# EasyEDA Pro project ProPrj_ftdi-jtag-xilinx_2025-01-10_v2.epro, board PCB1
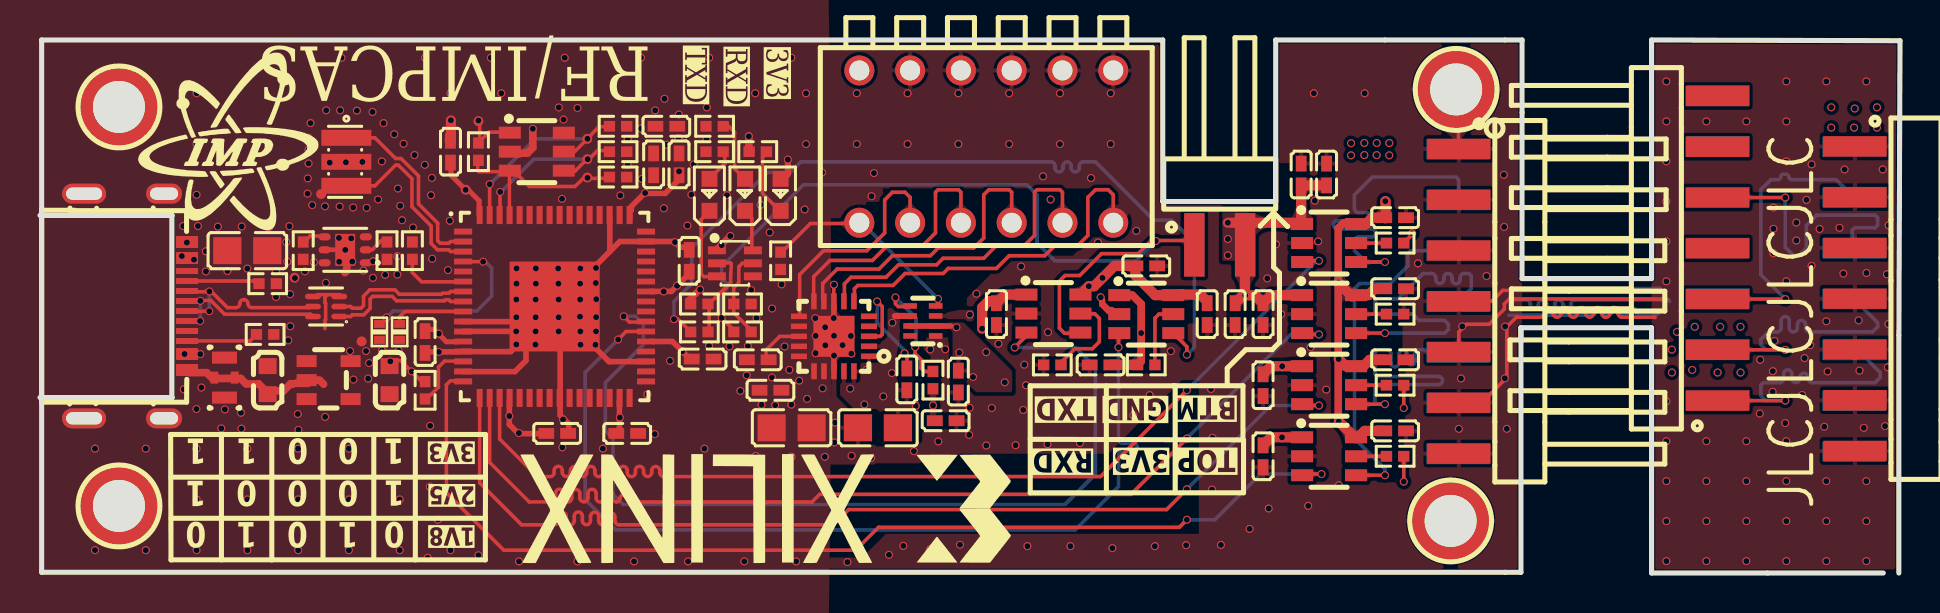
[diagram p3: board, top side]
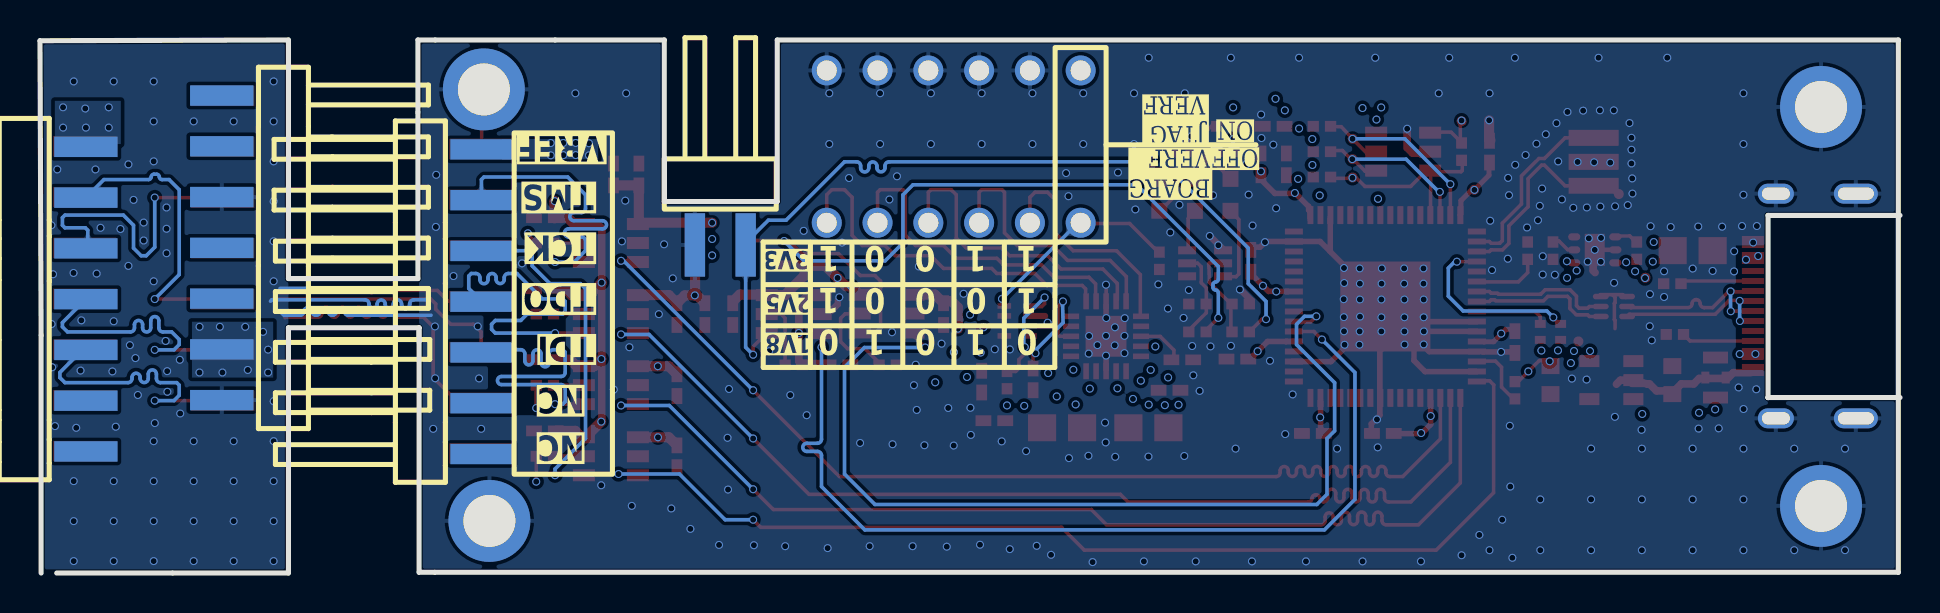
[diagram p4: board, bottom side, seen from below]

Outline 93.03 x 26.67 mm; copper layers: Top Layer, Inner1, Inner2, Bottom Layer. Coordinates in mm from the lower left corner of the outline.
Outline path: 74.07,12.27 80.6,12.27 80.6,0 92.19,0 ; 74.07,12.27 74.07,11.57 ; 74.07,12.27 74.07,0.04 0.08,0.04 0.08,26.67 56.15,26.67 56.15,18.59 61.8,18.59 61.8,26.67 74.12,26.67 74.12,14.73 80.6,14.73 80.6,19.3 80.6,19.3 80.6,26.67 93.03,26.63 92.97,11.9 92.97,0
Stack: Top Layer 0.035mm 外层铜厚1oz / Dielectric1 0.2104mm 7628 RC49% 8.6mil / Inner1 0.0152mm 内层铜厚 / Dielectric2 1.065mm 1.1mm H/HOZ Copper / Inner2 0.0152mm 内层铜厚 / Dielectric3 0.2104mm 7628 RC49% 8.6mil / Bottom Layer 0.035mm 外层铜厚1oz

## Design rules (mm)
net USB_DP_O: USB2
net USB_DN_O: USB2
net USB_DN: USB1
net USB_DP: USB1
net OSCO: OSC
net OSCI: OSC
template: 自定义配置
spacing copperThickness1oz (default): track to track 0.102, other pairs 0.152 to 0.3
spacing copperThickness2oz: track to track 0.203, other pairs 0.152 to 0.3
track width copperThickness1oz (default): min 0.127, default 0.178, max 2.54
track width copperThickness2oz: min 0.203, default 0.254, max 2.54
differential pair differentialPair (default): width min 0.127, default 0.254, max 2.54; gap min 0.152, default 0.152
via viaSize (default): diameter min 0.4, default 0.4, max 10; hole min 0.3, default 0.3, max 6.299

## Placement (name value [footprint] x y rotation side)
C1  100nF  [C0402]  25.87 6.98 180 top
C2  100nF  [C0402]  29.37 6.98 180 top
C3  100nF  [C0402]  32.47 15.62 270 top
C4  100nF  [C0402]  30.69 20.45 270 top
C5  100nF  [C0402]  59.77 12.95 90 top
C6  100nF  [C0402]  64.35 19.94 270 top
C7  100nF  [C0402]  55.33 15.37 180 top
C8  100nF  [C0402]  47.84 12.95 90 top
C9  100nF  [C0402]  31.96 20.45 270 top
C10  100nF  [C0402]  33.14 10.7 180 top
C11  100nF  [C0402]  20.53 21.08 270 top
C12  10uF  [C0603]  11.39 9.65 270 top
C13  4.7uF  [C0402]  19.26 11.56 270 top
C14  100nF  [C0402]  31.33 22.35 180 top
C15  NFM21PC104R1E3D  [CAP-SMD_4P-L2.0-W1.25]  9.23 9.78 270 top
C16  10uF  [C0603]  17.48 9.65 90 top
C17  22uF  [C0805]  10.37 16.13 0 top
C23  22uF  [C0805]  37.59 7.27 180 top
C24  100nF  [C0402]  36.53 9.14 180 top
C25  22uF  [C0805]  41.91 7.27 180 top
C26  100nF  [C0402]  61.17 12.95 90 top
C27  100nF  [C0402]  45.3 7.62 180 top
C28  100nF  [C0402]  67.78 17.78 180 top
C29  100nF  [C0402]  45.93 9.58 90 top
C30  10nF  [C0402]  35.9 10.67 180 top
C31  10nF  [C0402]  43.35 9.69 90 top
C32  100nF  [C0402]  61.17 9.4 90 top
C33  100nF  [C0402]  58.38 12.95 90 top
C34  100nF  [C0402]  53.04 10.41 0 top
C35  100nF  [C0402]  67.78 7.11 180 top
C36  100nF  [C0402]  63.08 19.94 270 top
C37  100nF  [C0402]  67.78 14.22 180 top
C38  100nF  [C0402]  61.17 5.84 90 top
C39  100nF  [C0402]  67.78 10.67 180 top
L1  ECMF02-2AMX6  [UFQFN-6_L1.7-W1.5]  14.31 13.33 180 top
L2  BLM15PD121SN1D  [L0402]  17.99 12.06 270 top
L3  BLM15PD121SN1D  [L0402]  16.98 12.06 90 top
LED1  NCD0603Y1  [LED0603-RD]  37.04 18.92 90 top
LED2  NCD0603Y1  [LED0603-RD]  35.26 18.92 90 top
LED3  NCD0603Y1  [LED0603-RD]  33.49 18.92 90 top
Q1  BSS138PS,115  [SOT-363_L2.0-W1.3-P0.65-LS2.1-BR]  34.75 15.49 180 top
R1  5.1kΩ  [R0402]  11.26 11.94 180 top
R2  5.1kΩ  [R0402]  11.39 14.48 180 top
R3  10kΩ  [R0402]  35.9 21.08 0 top
R4  10kΩ  [R0402]  33.74 22.35 180 top
R5  100kΩ  [R0402]  32.98 13.46 0 top
R6  56kΩ  [R0402]  17.36 16.13 270 top
R7  100Ω  [R0402]  32.98 12.06 180 top
R8  100kΩ  [R0402]  35.14 13.46 0 top
R9  100Ω  [R0402]  35.14 12.06 0 top
R10  10kΩ  [R0402]  28.91 22.35 180 top
R11  10kΩ  [R0402]  28.91 21.08 180 top
R12  200kΩ  [R0402]  13.17 16.13 270 top
R13  10kΩ  [R0402]  33.74 21.08 0 top
R14  12kΩ  [R0402]  18.63 16.13 270 top
R15  1kΩ  [R0402]  19.26 9.14 270 top
R18  2kΩ  [R0402]  21.93 21.08 270 top
R19  10kΩ  [R0402]  28.91 19.81 0 top
R20  10kΩ  [R0402]  44.66 9.65 90 top
R21  10kΩ  [R0402]  37.04 15.62 90 top
R22  10kΩ  [R0402]  67.78 5.84 0 top
R23  10kΩ  [R0402]  67.78 9.4 0 top
R24  10kΩ  [R0402]  67.78 12.95 0 top
R25  10kΩ  [R0402]  67.78 16.51 0 top
R26  10kΩ  [R0402]  55.33 10.41 180 top
R27  10kΩ  [R0402]  50.63 10.41 180 top
SW1  SMQP-06B-TP  [SW-TH_12P-P2.54_SMQP-06B-TP]  47.33 21.34 180 top
TP1  -  [Test-Point-0.5mm]  21.29 19.18 0 top
TP2  -  [Test-Point-0.5mm]  12.73 14.78 270 top
TP3  -  [Test-Point-0.5mm]  16.09 11.59 0 top
TP4  -  [Test-Point-0.5mm]  27.37 21.72 0 top
TP5  -  [Test-Point-0.5mm]  27.37 20.71 0 top
TP6  -  [Test-Point-0.5mm]  21.93 22.61 0 top
TP9  -  [Test-Point-0.5mm]  27.37 19.79 0 top
TP13  -  [Test-Point-0.5mm]  14.06 18.96 0 top
U1  -  [JTAG_V3]  71.08 13.59 0 top
U2  FT2232HQ-REEL  [QFN-64_L9.0-W9.0-P0.50-TL-EP4.3]  25.74 13.33 0 top
U3  -  [2x2p侧贴排针]  59 16.42 90 top
U4  TPS25200DRVR  [WSON-6_L2.0-W2.0-P0.65-TL-EP]  15.27 16.17 180 top
U5  TPS7A2033PDBVR  [SOT-23-5_L2.9-W1.6-P0.95-LS2.8-BR]  14.44 9.65 180 top
U6  93LC56BT-I/OT  [SOT-23-6_L2.9-W1.6-P0.95-LS2.8-BR]  24.85 21.08 180 top
U11  TPS7A8300RGRR  [VQFN-20_L3.5-W3.5-P0.50-BL-EP2.0]  39.71 11.84 90 top
U12  -  [M2焊接螺柱]  3.95 23.32 0 top
U13  -  [M2焊接螺柱]  70.55 2.61 90 top
U14  -  [M2焊接螺柱]  3.95 3.36 0 top
U15  -  [M2焊接螺柱]  70.83 24.2 90 top
U16  TPS2116DRLR  [SOT-583-8_L2.1-W1.6-P0.50-LS1.6-BL]  44.16 12.61 90 top
U22  SN74LVC1T45DBVR  [SOT-23-6_L2.9-W1.6-P0.95-LS2.8-BR]  64.47 5.84 180 top
U23  SN74LVC1T45DBVR  [SOT-23-6_L2.9-W1.6-P0.95-LS2.8-BR]  64.47 9.4 180 top
U24  SN74LVC1T45DBVR  [SOT-23-6_L2.9-W1.6-P0.95-LS2.8-BR]  64.47 12.95 180 top
U25  SN74LVC1T45DBVR  [SOT-23-6_L2.9-W1.6-P0.95-LS2.8-BR]  64.47 16.51 180 top
U26  SN74LVC1T45DBVR  [SOT-23-6_L2.9-W1.6-P0.95-LS2.8-BR]  55.33 12.95 180 top
U27  SN74LVC1T45DBVR  [SOT-23-6_L2.9-W1.6-P0.95-LS2.8-BR]  50.69 12.98 180 top
U28  -  [JTAG_V3]  90.89 13.72 0 top
U29  -  [JTAG_V3]  83.78 16.26 180 top
USB1  TYPEC-302-BRP16SC16  [USB-C-SMD_TYPEC-302-BRP16SC16]  4.78 13.36 270 top
X1  12MHz  [CRYSTAL-SMD_3P-L3.2-W1.3-P1.2-BL]  15.32 20.57 270 top

## Footprints (pads in the part's own frame, mm; a bottom-side part is the same pattern mirrored in y, then rotated)
2x2p侧贴排针
  rect 3.17x1.02 smd: 1(0,1.27) 3(0,-1.27)
  rect 3.17x1.02 smd far side: 2(0,1.27) 4(0,-1.27)
C0402
  rect 0.79x0.54 smd: 1(-0.545,0) 2(0.545,0)
C0603
  rect 0.8x0.9 smd: 1(-0.7,0) 2(0.7,0)
C0805
  rect 1.41x1.35 smd: 1(-1,0) 2(1,0)
CAP-SMD_4P-L2.0-W1.25
  rect 0.6x1.25 smd: 1(-1,0) 3(1,0)
  rect 0.6x0.4 smd: 2(0,-0.508) 4(0,0.508)
CRYSTAL-SMD_3P-L3.2-W1.3-P1.2-BL
  rect 0.8x2.5 smd: 1(-1.2,0) 2(0,0) 3(1.2,0)
JTAG_V3
  rect 3.17x1.02 smd: 1(-0.114,7.63) 3(-0.114,5.09) 5(-0.114,2.55) 7(-0.114,0.01) 9(-0.114,-2.53) 11(-0.114,-5.07) 13(-0.114,-7.61)
  rect 3.17x1.02 smd far side: 2(-0.158,7.606) 4(-0.158,5.066) 6(-0.158,2.526) 8(-0.158,-0.014) 10(-0.158,-2.554) 12(-0.158,-5.094) 14(-0.158,-7.634)
L0402
  rect 0.4x0.55 smd: 1(-0.4,0) 2(0.4,0)
LED0603-RD
  rect 0.8x0.8 smd: 1(-0.799,0) 2(0.799,0)
M2焊接螺柱
  round 4.1 hole 2.6: 1(0,0)
QFN-64_L9.0-W9.0-P0.50-TL-EP4.3
  rect 0.9x0.3 smd: 1(-4.575,3.75) 2(-4.575,3.25) 3(-4.575,2.75) 4(-4.575,2.25) 5(-4.575,1.75) 6(-4.575,1.25) 7(-4.575,0.75) 8(-4.575,0.25) 9(-4.575,-0.25) 10(-4.575,-0.75) 11(-4.575,-1.25) 12(-4.575,-1.75) 13(-4.575,-2.25) 14(-4.575,-2.75) 15(-4.575,-3.25) 16(-4.575,-3.75) 33(4.575,-3.75) 34(4.575,-3.25) 35(4.575,-2.75) 36(4.575,-2.25) 37(4.575,-1.75) 38(4.575,-1.25) 39(4.575,-0.75) 40(4.575,-0.25) 41(4.575,0.25) 42(4.575,0.75) 43(4.575,1.25) 44(4.575,1.75) 45(4.575,2.25) 46(4.575,2.75) 47(4.575,3.25) 48(4.575,3.75)
  rect 0.3x0.9 smd: 17(-3.75,-4.575) 18(-3.25,-4.575) 19(-2.75,-4.575) 20(-2.25,-4.575) 21(-1.75,-4.575) 22(-1.25,-4.575) 23(-0.75,-4.575) 24(-0.25,-4.575) 25(0.25,-4.575) 26(0.75,-4.575) 27(1.25,-4.575) 28(1.75,-4.575) 29(2.25,-4.575) 30(2.75,-4.575) 31(3.25,-4.575) 32(3.75,-4.575) 49(3.75,4.575) 50(3.25,4.575) 51(2.75,4.575) 52(2.25,4.575) 53(1.75,4.575) 54(1.25,4.575) 55(0.75,4.575) 56(0.25,4.575) 57(-0.25,4.575) 58(-0.75,4.575) 59(-1.25,4.575) 60(-1.75,4.575) 61(-2.25,4.575) 62(-2.75,4.575) 63(-3.25,4.575) 64(-3.75,4.575)
  rect 4.5x4.5 smd: 65(0,-0.001)
R0402
  rect 0.566x0.54 smd: 1(-0.433,0) 2(0.433,0)
SOT-23-5_L2.9-W1.6-P0.95-LS2.8-BR
  rect 1x0.6 smd: 1(1.1,-0.95) 2(1.1,0) 3(1.1,0.95) 4(-1.1,0.95) 5(-1.1,-0.95)
SOT-23-6_L2.9-W1.6-P0.95-LS2.8-BR
  rect 1.1x0.6 smd: 1(1.35,-0.95) 2(1.35,0) 3(1.35,0.95) 4(-1.35,0.95) 5(-1.35,0) 6(-1.35,-0.95)
SOT-363_L2.0-W1.3-P0.65-LS2.1-BR
  rect 0.9x0.4 smd: 1(0.9,-0.65) 2(0.9,0) 3(0.9,0.65) 4(-0.9,0.65) 5(-0.9,0) 6(-0.9,-0.65)
SOT-583-8_L2.1-W1.6-P0.50-LS1.6-BL
  rect 0.28x0.68 smd: 1(-0.75,-0.64) 2(-0.25,-0.64) 3(0.25,-0.64) 4(0.75,-0.64) 5(0.75,0.64) 6(0.25,0.64) 7(-0.25,0.64) 8(-0.75,0.64)
SW-TH_12P-P2.54_SMQP-06B-TP
  round 1.5 hole 1: 1(-6.35,-3.81) 2(-3.81,-3.81) 3(-1.27,-3.81) 4(1.27,-3.81) 5(3.81,-3.81) 6(6.35,-3.81) 7(6.35,3.81) 8(3.81,3.81) 9(1.27,3.81) 10(-1.27,3.81) 11(-3.81,3.81) 12(-6.35,3.81)
Test-Point-0.5mm
  round 0.5 smd: 1(0,0)
UFQFN-6_L1.7-W1.5
  oval 0.79x0.28 smd: 1(-0.657,0.5) 2(-0.657,0) 3(-0.657,-0.5) 4(0.657,-0.5) 5(0.657,0) 6(0.657,0.5)
USB-C-SMD_TYPEC-302-BRP16SC16
  rect 0.6x1.1 smd: 1(-3.2,2.575) 2(-2.4,2.575) 11(2.4,2.575) 12(3.2,2.575)
  rect 0.3x1.1 smd: 3(-1.75,2.575) 4(-1.25,2.575) 5(-0.75,2.575) 6(-0.25,2.575) 7(0.25,2.575) 8(0.75,2.575) 9(1.25,2.575) 10(1.75,2.575)
  oval 1x1.8 hole 0.61x1.4: 13(-5.62,1.425) 14(5.62,1.425)
  oval 1x2.2 hole 0.61x1.8: 15(-5.62,-2.575) 16(5.62,-2.575)
VQFN-20_L3.5-W3.5-P0.50-BL-EP2.0
  rect 0.28x0.8 smd: 1(-1.001,-1.751) 2(-0.501,-1.751) 3(-0.001,-1.751) 4(0.499,-1.751) 5(1,-1.749) 11(0.999,1.749) 12(0.501,1.751) 13(-0.001,1.749) 14(-0.501,1.749) 15(-1.001,1.749)
  rect 0.8x0.28 smd: 6(1.75,-0.999) 7(1.75,-0.499) 8(1.75,0.001) 9(1.75,0.501) 10(1.75,1.001) 16(-1.75,0.999) 17(-1.75,0.499) 18(-1.75,-0.001) 19(-1.75,-0.501) 20(-1.75,-1.001)
  rect 2.05x2.05 smd: 21(-0.001,-0.001)
WSON-6_L2.0-W2.0-P0.65-TL-EP
  oval 0.607x0.364 smd: 1(-1.028,0.65) 2(-1.028,0) 3(-1.028,-0.65) 4(1.028,-0.65) 5(1.028,0) 6(1.028,0.65)
  rect 1x1.6 smd: 7(0,0)

## Nets
As in the schematic.

Pads without a net: U1 12 14; U2 21 22 23 24 26 27 28 29 30 32 33 34 36 40 41 43 44 45 46 48 52 53 54 55 57 58 59 60; U4 3; U5 4; U11 4 5 12; U16 8; U28 12 14; U29 6 7 8 11 12 13 14; USB1 3 9

## Via types
v1: diameter 0.4, hole 0.3, Top Layer to Bottom Layer, 499 vias

## Routing (per net, layer and track width the routed paths; a pad name or vN(x,y) marks a point on that pad's centre or on a via; arc(x,y) is an arc through that point)
3V3: length 40.4
  Top Layer w0.178: 19.14,9.53 18.04,10.63 17.74,10.63 ; v1(68.63,17) 68.63,16.93 R25.2 ; R22.2 v1(68.21,4.57) ; R23.2 v1(68.21,8.25)
  Top Layer w0.28: 30.58,14.09 31.58,14.09 32.44,14.95 ; 28.71,6.96 28.98,7.23 28.98,8.62 ; 25.2,6.98 23.93,6.98 23.47,7.43 v1(23.47,7.85) 23.47,8.6
  Top Layer w0.305: v1(37.4,20.69) 37.4,19.95 37.04,19.58
  Top Layer w0.381: 54.92,10.44 55.08,10.59 55.08,13.46 54.63,13.9 U26.1
  Top Layer w0.508: v1(47.12,12.22) 47.12,13.28 47.44,13.6 47.89,13.6 ; C32.2 61.58,10.35 v1(62.13,10.35) U23.1 ; 60.26,14.13 60.26,16.41 60.27,16.42 ; 60.26,14.13 60.28,14.12 v1(60.28,13.89) ; 60.26,14.13 60.26,13.91 v1(60.28,13.89) ; U27.1 48.27,13.93 C8.2 ; 63.12,6.79 v1(62.12,6.79) 61.58,6.79 C38.2 ; 54.92,10.44 54.78,10.41 53.53,10.41 ; v1(59.41,17.53) 63.06,17.53 63.08,17.51 ; v1(60.28,13.89) 60.78,13.89 C26.2 61.58,13.9 U24.1 ; v1(60.28,13.89) 60.16,13.89 C5.2 ; C6.2 C36.2 63.08,17.51 ; 63.08,17.51 U25.1
  vias: v1(15.51,11.11) v1(16.31,11.11) v1(16.46,10.51) v1(17.11,11.14) v1(17.52,10.59) v1(17.94,11.13) v1(18.59,10.09) v1(23.95,7) v1(25.95,23.29) v1(26.11,18.72) v1(26.19,22.69) v1(26.88,23.27) v1(29.02,18.89) v1(29,7.79) v1(29.4,21.71) v1(29.39,20.42) v1(30.05,22.24) v1(30.1,19.72) v1(30.77,23.15) v1(31.2,14.09) v1(31.23,23.73) v1(31.86,14.37) v1(33.35,23.3) v1(33.34,21.71) v1(44.66,8.39) v1(55.07,12.01) v1(59.41,16.71) v1(59.41,15.89)
+5V:
  vias: v1(9.25,8.19) v1(10.05,8.02) v1(12.89,7.96) v1(16.17,15.13) v1(16.66,15.6) v1(16.65,14.77) v1(36.09,8.42) v1(36.61,9.78) v1(36.77,8.4) v1(37.24,11.33) v1(37.48,10.16) v1(37.58,8.42) v1(37.97,9.62) v1(38.36,8.71) v1(39.14,9.24)
GND: length 119.9
  Top Layer w0.178: v1(39.71,14.43) 39.7,14.41 39.71,13.37 ; 70.94,21.25 70.94,23.16 ; 53.67,12.95 53.67,13.17 53.62,13.23 53.47,13.23 53.19,13.5 53.19,13.66 53.05,13.79 ; 53.05,13.79 53.05,13.41 53.42,13.04 53.55,13.17 ; 53.05,13.79 53.05,13.81 ; U1.7 72.61,13.6 73.15,14.14 81.03,14.14 ; 80.77,12.78 80.75,12.8 79.13,12.8 arc(78.98,12.86) 78.92,13 78.92,13.08 arc(78.72,13.28) 78.52,13.08 78.52,13 arc(78.31,12.8) 78.11,13 78.11,13.08 arc(77.91,13.28) 77.7,13.08 77.7,13 arc(77.5,12.8) 77.3,13 77.3,13.08 arc(77.09,13.28) 76.89,13.08 76.89,13 arc(76.69,12.8) 76.48,13 76.48,13.08 arc(76.28,13.28) 76.08,13.08 76.08,13 arc(75.88,12.8) 75.67,13 75.67,13.08 arc(75.47,13.28) 75.27,13.08 75.27,13 arc(75.21,12.86) 75.06,12.8 73.84,12.8 73.36,12.32 73.36,9.78 72.1,8.52 U1.11 ; 14.37,13.92 14.25,13.8 14.25,13.53 14.29,13.49 14.29,12.68 14.25,12.64 14.25,12.23 ; 15.03,13.88 14.99,13.93 13.87,13.93 13.72,13.78 ; U1.9 70.96,12.06 71.34,12.45 72.48,12.45 73.24,13.2 73.24,13.46 73.49,13.72 81.36,13.72
  Top Layer w0.229: 14.38,16.17 14.85,16.17 14.86,16.16
  Top Layer w0.28: 24.01,12.2 23.89,12.09 21.16,12.09 ; 39.77,12.02 39.71,11.96 39.71,10.17 ; 19.3,11.06 v1(19.95,11.06) 20.91,11.06 ; 32.37,16.3 32.01,16.3 31.73,16.59 29,16.59 28.5,16.08 28.5,17.77 ; 26.45,6.96 26.45,7.46 26.02,7.89 26.02,11.11 25.79,11.33 ; 30.45,10.58 28.46,10.58 27.54,11.49 ; 28.44,16.03 27.7,15.28 ; 21.08,11.08 23.54,11.08 23.74,11.27 ; 21.16,12.58 23.71,12.58 ; 21.16,10.08 23.75,10.08 24.31,10.63 24.31,11.33 24.32,11.34 ; 39.71,12.02 39.71,13.37
  Top Layer w0.33: 33.01,14.2 32.46,13.65 32.46,13.46 ; 33.8,16.15 34.51,16.85 34.52,16.85
  Top Layer w0.381: 12.6,9.45 12.63,9.45 arc(12.73,9.48) 12.83,9.49 13.4,9.49 13.51,9.61 ; 15.35,15.92 15.35,15.13 15.25,15.03 ; 8.73,9.74 9.64,9.74 ; 9.64,9.74 10.04,9.74 10.31,9.46 10.94,9.46 11.52,8.88 ; 9.64,9.74 9.67,9.77 ; 14.18,9.45 13.98,9.65 13.48,9.65 ; 35.45,21.04 35.45,21.87 ; 7.47,10.02 8.33,10.02 8.62,9.74 ; v1(24.65,22.23) 24.65,21.28 24.37,21.01 23.47,21.01 ; 11.34,9.11 12.18,9.11 12.53,9.46 12.59,9.46
  Top Layer w0.508: 20.55,22.65 20.55,21.71 20.49,21.65
  Bottom Layer w0.178: 73.47,12.9 77.61,12.9 arc(77.74,12.95) 77.8,13.08 arc(77.85,13.21) 77.98,13.27 78.02,13.27 arc(78.15,13.21) 78.2,13.08 arc(78.26,12.95) 78.39,12.9 78.43,12.9 arc(78.56,12.95) 78.61,13.08 arc(78.67,13.21) 78.8,13.27 78.83,13.27 arc(78.96,13.21) 79.02,13.08 arc(79.07,12.95) 79.2,12.9 79.24,12.9 arc(79.37,12.95) 79.42,13.08 arc(79.48,13.21) 79.61,13.27 79.65,13.27 arc(79.78,13.21) 79.83,13.08 arc(79.88,12.95) 80.01,12.9 80.83,12.9 80.94,13.01 ; 73.61,13.67 74.34,13.67 arc(74.48,13.61) 74.54,13.46 74.54,13.44 arc(74.74,13.23) 74.94,13.44 74.94,13.46 arc(75.15,13.67) 75.35,13.46 75.35,13.44 arc(75.56,13.23) 75.76,13.44 75.76,13.46 arc(75.96,13.67) 76.16,13.46 76.16,13.45 arc(76.37,13.25) 76.57,13.45 76.57,13.46 arc(76.63,13.61) 76.77,13.67 81.43,13.67 81.5,13.6 ; 73.56,14.24 81.02,14.24
  vias: v1(2.75,6.22) v1(2.75,1.14) v1(5.29,6.22) v1(5.29,1.14) v1(7.16,17.36) v1(7.19,9.19) v1(7.35,16.54) v1(7.83,24) v1(7.83,21.46) v1(7.83,18.92) v1(7.83,8.21) v1(7.83,6.22) v1(7.83,3.68) v1(7.83,1.14) v1(7.9,17.36) v1(8.07,9.28) v1(8.3,16.1) v1(8.3,15.09) v1(8.9,17.33) v1(9.07,7.24) v1(9.37,15.11) v1(10.09,17.34) v1(10.07,7.23) v1(10.37,15.23) v1(10.37,6.22) v1(10.37,3.68) v1(10.37,1.14) v1(11.47,17.31) v1(11.64,25.78) v1(11.8,15.1) v1(11.8,13.81) v1(12.42,11.64) v1(12.47,17.35) v1(12.51,13.95) v1(12.52,12.35) v1(12.92,7.16) v1(12.91,6.22) v1(12.91,3.68) v1(12.91,1.14) v1(13.43,21.78) v1(13.43,21.18) v1(13.43,20.49) v1(13.39,19.74) v1(13.38,18.98) v1(13.53,22.51) v1(13.62,18.41) v1(14.31,23.15) v1(14.25,18.35) v1(14.3,14.52) v1(14.26,7.81) v1(14.49,20.53) v1(15.01,23.15) v1(14.99,18.33) v1(14.95,16.77) v1(14.96,15.57) v1(15.08,25.78) v1(15.3,20.55) v1(15.27,16.17) v1(15.45,6.22) v1(15.45,3.68) v1(15.45,1.14) v1(15.56,16.74) v1(15.62,15.58) v1(15.66,18.29) v1(15.68,9.68) v1(15.85,23.13) v1(16.12,20.57) v1(16.34,18.27) v1(16.41,9.73) v1(16.63,23.07) v1(16.91,18.69) v1(17.1,20.6) v1(17.18,22.51) v1(17.26,14.92) v1(17.72,21.95) v1(17.9,19.24) v1(17.87,15.85) v1(17.87,14.93) v1(18.02,18.37) v1(17.99,3.68) v1(17.99,1.14) v1(18.11,17.65) v1(18.18,21.48) v1(18.73,20.91) v1(18.65,17.29) v1(19.26,25.78) v1(19.25,20.42) v1(19.39,0.76) v1(19.52,7.37) v1(19.49,4.32) v1(19.6,19.77) v1(19.56,18.9) v1(19.62,15.72) v1(19.9,2.67) v1(20.41,15.16) v1(20.53,24) v1(20.5,17.62) v1(20.53,1.14) v1(20.55,22.65) v1(21.04,1.91) v1(21.93,0.89) v1(22.55,25.78) v1(23.07,24) v1(23.83,15.24) v1(23.83,14.48) v1(23.82,13.68) v1(23.82,12.79) v1(23.82,12.09) v1(23.82,11.44) v1(23.96,0.58) v1(24.8,15.24) v1(24.8,14.48) v1(24.79,13.68) v1(24.79,12.79) v1(24.79,12.09) v1(24.78,11.43) v1(25.92,15.24) v1(25.93,14.48) v1(25.94,13.68) v1(25.94,12.79) v1(25.94,12.09) v1(26.12,6.29) v1(26.16,7.68) v1(26.25,25.78) v1(26.88,0.58) v1(27.03,15.24) v1(27.01,14.48) v1(27.01,13.68) v1(27.01,12.83) v1(27.03,12.09) v1(27.04,11.42) v1(27.81,15.26) v1(27.8,14.51) v1(27.82,13.7) v1(27.82,12.8) v1(27.81,12.09) v1(27.78,11.42) v1(28.15,6.22) v1(29.71,0.58) v1(30.06,25.78) v1(30.38,8.93) v1(30.75,6.95) v1(31.2,18.25) v1(31.34,21.43) v1(31.51,10.62) v1(31.76,16.56) v1(31.95,22.94) v1(31.94,21.76) v1(32.38,17.38) v1(32.41,0.58) v1(32.58,18.93) v1(32.7,20.45) v1(33.01,14.19) v1(33.23,6.22) v1(33.47,25.78) v1(33.46,11.37) v1(34.09,16.4) v1(34.36,18.9) v1(34.52,16.86) v1(34.49,11.34) v1(35.03,9.11) v1(35.22,0.58) v1(35.4,11.36) v1(35.34,9.89) v1(35.45,21.85) v1(35.57,14.16) v1(35.77,24) v1(35.83,12.76) v1(35.8,5.85) v1(36.04,18.42) v1(36.5,17.04) v1(36.61,13.23) v1(37.09,14.44) v1(37.58,25.78) v1(37.59,5.83) v1(37.82,0.58) v1(38.31,24) v1(38.31,21.46) v1(38.24,18.19) v1(38.78,12.75) v1(38.79,11.87) v1(38.79,11) v1(39.11,20.04) v1(39.27,12.3) v1(39.28,11.39) v1(39.25,5.81) v1(39.7,12.76) v1(39.71,11.87) v1(39.71,10.88) v1(39.73,6.54) v1(39.76,7.52) v1(40.14,11.4) v1(40.38,0.55) v1(40.56,11.86) v1(40.58,10.98) v1(40.59,5.86) v1(40.85,24) v1(40.85,21.46) v1(41.59,18.85) v1(41.56,5.75) v1(41.71,20.01) v1(42.46,0.91) v1(43.18,1.36) v1(43.39,24) v1(43.39,21.46) v1(43.71,6.1) v1(44.52,11.19) v1(44.53,1.2) v1(44.93,6.59) v1(45.27,11.2) v1(45.93,24) v1(45.93,21.46) v1(46.01,1.42) v1(46.49,8.27) v1(46.47,6.91) v1(46.83,13.97) v1(47.33,6.38) v1(47.6,8.26) v1(47.67,1.32) v1(47.94,11.47) v1(48.47,24) v1(48.47,21.46) v1(48.79,6.39) v1(49.07,15.34) v1(49.23,10.42) v1(49.18,8.16) v1(49.32,9.4) v1(49.38,1.34) v1(50.17,19.85) v1(50.41,12.05) v1(50.39,6.44) v1(50.55,18.69) v1(51.01,24) v1(51.01,21.46) v1(51.53,1.34) v1(52.01,6.51) v1(52.56,19.76) v1(52.91,16.53) v1(53.05,13.8) v1(53.55,24) v1(53.55,21.46) v1(53.63,1.25) v1(54.68,7.9) v1(54.83,17.12) v1(55.5,8.9) v1(55.76,1.34) v1(56.56,11.1) v1(57.32,1.39) v1(58.57,9.21) v1(58.62,4.18) v1(58.64,6.77) v1(59.06,1.41) v1(60.5,2.21) v1(61.38,14.74) v1(61.45,3.23) v1(61.81,16.45) v1(62.07,12.95) v1(63.43,3.36) v1(63.55,11.3) v1(63.71,24) v1(63.76,18.63) v1(63.92,16.59) v1(64.33,9.18) v1(64.96,4.39) v1(66.25,24) v1(68.92,15.49) v1(70.96,7.21) v1(71.13,12.34) v1(71.07,9.74) v1(72.35,14.86) v1(73.21,19.92) v1(73.23,17.32) v1(73.28,12.34) v1(73.26,9.74) v1(73.36,7.21) v1(81.34,24.6) v1(81.34,22.6) v1(81.34,20.6) v1(81.34,18.6) v1(81.34,16.6) v1(81.34,14.6) v1(81.34,8.6) v1(81.34,6.6) v1(81.34,4.6) v1(81.34,2.6) v1(81.34,0.6) v1(83.34,22.6) v1(83.34,6.6) v1(83.34,4.6) v1(83.34,2.6) v1(83.34,0.6) v1(85.34,22.6) v1(85.34,6.6) v1(85.34,4.6) v1(85.34,2.6) v1(85.34,0.6) v1(86.01,7.98) v1(86.03,10.67) v1(86.7,18.29) v1(86.7,17.22) v1(86.7,16) v1(86.67,10.1) v1(86.66,9.07) v1(86.74,11.61) v1(87.28,7.5) v1(87.34,24.6) v1(87.34,22.6) v1(87.34,20.6) v1(87.34,14.6) v1(87.34,6.6) v1(87.34,4.6) v1(87.34,2.6) v1(87.34,0.6) v1(87.84,17.54) v1(87.84,16.64) v1(88.13,8.91) v1(88.25,10.75) v1(88.35,18.67) v1(88.53,11.4) v1(88.6,20.45) v1(88.6,15.37) v1(89,17.21) v1(89.24,7.32) v1(89.34,24.6) v1(89.34,12.6) v1(89.41,10.09) v1(89.34,4.6) v1(89.34,2.6) v1(89.34,0.6) v1(90,17.27) v1(90.19,14.98) v1(90.25,20.19) v1(90.96,12.64) v1(91,10.13) v1(91.21,7.27) v1(91.34,24.6) v1(91.35,15.01) v1(91.34,4.6) v1(91.34,2.6) v1(91.34,0.6) v1(92.16,20.19) v1(92.28,7.35) v1(92.38,14.95) v1(92.42,10.3) v1(92.46,17.4) v1(92.45,12.46)
VCCB: length 30.3
  Top Layer w0.28: 43.47,12.36 45.55,12.36
  Top Layer w0.381: 65.67,17.5 65.18,17.5 64.93,17.25 64.93,7.59
  Top Layer w0.508: 57.01,13.93 58.03,13.93 58.36,13.6 ; C35.2 66.25,7.11 65.93,6.79 ; U26.6 55.78,13.9 54.78,14.9 C7.2 53.74,15.37 v1(53.14,14.76) 52.72,14.35 v1(52.46,14.35) U27.6 ; v1(67.28,18.61) 67.3,18.59 67.3,17.74 ; 65.62,13.84 64.94,14.52 v1(64.94,14.53) ; U24.6 66.44,13.9 66.76,14.22 C37.2 ; C39.2 66.5,10.67 66.19,10.35 66.1,10.35 65.31,10.35 v1(64.95,10.71) ; C28.2 66.63,17.78 66.31,17.46 U25.6 ; 65.79,6.74 64.96,7.57
  vias: v1(45.84,12.29) v1(45.98,11.03) v1(46.66,9.81) v1(47.32,11.05) v1(48.25,9.54) v1(64.96,7.57)
100MV: length 18.2
  Top Layer w0.178: 40.73,13.63 40.73,14.22 40.9,14.39 42.67,14.39 43.26,14.99 45.17,14.99 45.42,15.24 47.84,15.24 48.47,15.88 50.25,15.88 50.76,16.38 51.9,16.38 52.41,16.89 52.41,18.8 52.79,19.18 53.42,19.18 53.68,18.92 SW1.12
200MV: length 16.6
  Top Layer w0.178: SW1.11 51.14,19.05 51.01,19.18 49.87,19.18 49.74,19.05 49.74,16.89 49.23,16.38 47.84,16.38 47.2,15.75 45.17,15.75 44.84,15.42 42.94,15.42 42.31,14.8 40.56,14.8 40.23,14.47 40.23,13.59 ; 51.15,17.43 51.2,17.43
400MV: length 15
  Top Layer w0.178: 39.15,13.68 39.15,14.49 39.87,15.21 41.96,15.21 42.63,15.88 44.53,15.88 44.92,16.26 46.7,16.26 47.2,16.76 47.2,18.92 47.46,19.18 48.47,19.18 48.6,19.05 SW1.10
800MV: length 13.3
  Top Layer w0.178: 38.69,13.43 38.69,14.83 39.5,15.64 41.63,15.64 42.38,16.38 44.15,16.38 44.79,17.02 44.79,19.05 44.91,19.18 45.93,19.18 46.06,19.05 SW1.9
1600MV: length 11.8
  Top Layer w0.178: 38,12.82 38,12.86 ; 38,12.86 38,14.93 ; 38,12.86 38.09,12.86 ; 37.99,14.93 39.18,16.12 41.35,16.12 42.25,17.02 42.25,18.67 42.63,19.05 43.26,19.05 43.52,18.8 SW1.8
EE_CLK: length 8.6
  Top Layer w0.178: 23.01,17.88 23.01,19.08 ; 27.29,20.64 26.75,20.1 26.24,20.1 ; 27.45,20.7 27.89,21.14 28.37,21.14
  Bottom Layer w0.178: 23.07,19.08 24.7,20.71 v1(27.39,20.71)
  vias: v1(23.02,19.07)
EE_CS: length 10.3
  Top Layer w0.178: 27.36,21.7 27.54,21.88 ; 27.36,21.7 27.94,22.33 28.28,22.33 ; 27.36,21.7 26.66,21.01 26.04,21.01 ; 22.49,18.05 22.49,19.47
  Bottom Layer w0.178: v1(27.38,21.72) 24.76,21.72 22.49,19.45
  vias: v1(22.49,19.46)
EE_DI: length 9.6
  Top Layer w0.178: 27.37,19.81 27.23,19.81 26.76,19.34 24.47,19.34 23.73,20.08 23.62,20.08 ; 21.89,20.56 21.89,20.14 21.95,20.08 23.53,20.08 ; 27.42,19.75 28.33,19.75 28.4,19.81 ; 23.58,20.1 23.48,19.99 23.48,18.03 23.45,18.01 23.45,17.89
  vias: v1(27.39,19.77)
EE_DO: length 2.7
  Top Layer w0.178: 23.53,22.06 22.45,22.06 22.02,21.62 ; 21.99,21.54 21.99,22.52 21.98,22.54
  vias: v1(21.93,22.64)
INT_VERF: length 0.8
  Top Layer w0.305: U16.6 42.76,12.86
  vias: v1(40.52,9.22) v1(41.23,8.44) v1(41.34,10.17) v1(42.18,8.84) v1(42.63,12.52) v1(42.61,10) v1(43.8,8.36)
JTAG_TCK: length 54
  Top Layer w0.178: U22.3 63.18,4.95 v1(64.09,4.95) ; 21.27,9.62 20.53,9.62 20.32,9.41 20.33,4.01 23.2,1.14 40.79,1.14 41.94,2.29 56.98,2.29 v1(57.36,2.67)
  Bottom Layer w0.178: v1(64.09,4.95) 61.04,4.95 58.76,2.67 v1(57.36,2.67)
JTAG_TCK_O: length 17.7
  Top Layer w0.178: U22.4 v1(67.27,4.89)
  Bottom Layer w0.178: U1.6 70.91,16.13 68.54,16.13 68.41,16 68.41,15.37 67.52,14.48 66,14.48 65.74,14.22 65.74,6.73 67.27,5.21 v1(67.27,4.89)
JTAG_TDI: length 54
  Top Layer w0.178: v1(63.97,8.38) 63.19,8.38 U23.3 ; 21.99,8.67 21.99,4.51 24.09,2.41 25.71,2.41 arc(25.85,2.47) 25.91,2.62 25.91,2.84 arc(26.11,3.05) 26.31,2.84 26.31,2.62 arc(26.52,2.41) 26.72,2.62 26.72,2.84 arc(26.92,3.05) 27.13,2.84 27.13,2.62 arc(27.33,2.41) 27.53,2.62 27.53,2.84 arc(27.74,3.05) 27.94,2.84 27.94,2.62 arc(28.14,2.41) 28.35,2.62 28.35,2.81 arc(28.55,3.01) 28.75,2.81 28.75,2.62 arc(28.81,2.47) 28.96,2.41 39.68,2.41 40.44,3.17 56.34,3.17 v1(57.36,4.19)
  Bottom Layer w0.178: v1(63.97,8.38) 61.55,8.38 v1(57.36,4.19)
JTAG_TDI_O: length 17.7
  Top Layer w0.178: U23.4 v1(67.27,8.45)
  Bottom Layer w0.178: U1.10 70.78,11.17 68.98,11.17 arc(68.84,11.12) 68.78,10.97 68.78,10.61 arc(68.58,10.41) 68.37,10.61 68.37,10.97 arc(68.17,11.17) 67.97,10.97 67.97,10.52 arc(67.76,10.32) 67.56,10.52 67.56,10.97 arc(67.5,11.12) 67.36,11.17 66.88,11.17 66.76,11.05 66.76,10.04 arc(66.82,9.89) 66.96,9.83 69.94,9.83 arc(70.15,9.63) 69.94,9.43 66.96,9.43 arc(66.82,9.37) 66.76,9.22 66.76,8.57 66.88,8.45 v1(67.27,8.45)
JTAG_TDO: length 54
  Top Layer w0.178: v1(57.36,6.73) 54.57,3.94 38.99,3.94 38.61,3.56 29.59,3.56 arc(29.47,3.61) 29.41,3.73 arc(29.36,3.86) 29.24,3.91 29.19,3.91 arc(29.06,3.86) 29.01,3.73 arc(28.96,3.61) 28.83,3.56 arc(28.69,3.62) 28.63,3.76 28.63,3.99 arc(28.42,4.19) 28.22,3.99 28.22,3.76 arc(28.02,3.56) 27.81,3.76 27.81,3.99 arc(27.61,4.19) 27.41,3.99 27.41,3.76 arc(27.2,3.56) 27,3.76 27,3.99 arc(26.8,4.19) 26.59,3.99 26.59,3.76 arc(26.39,3.56) 26.19,3.76 26.19,3.99 arc(25.99,4.19) 25.78,3.99 25.78,3.76 arc(25.72,3.62) 25.58,3.56 24.47,3.56 22.49,5.54 U2.18 ; U24.3 63.19,11.94 v1(63.97,11.94)
  Bottom Layer w0.178: v1(63.97,11.94) 62.57,11.94 v1(57.36,6.73)
JTAG_TDO_O: length 17.8
  Top Layer w0.178: U24.4 v1(67.27,12)
  Bottom Layer w0.178: U1.8 71.58,14.24 71.58,14.86 71.46,14.99 71.23,14.99 arc(71.09,14.93) 71.03,14.78 71.03,14.68 arc(70.82,14.48) 70.62,14.68 70.62,14.78 arc(70.42,14.99) 70.21,14.78 70.21,14.68 arc(70.01,14.48) 69.81,14.68 69.81,14.78 arc(69.75,14.93) 69.6,14.99 69.17,14.99 67.9,13.72 66.89,13.72 66.76,13.59 66.76,13.08 66.89,12.95 68.66,12.95 68.98,12.64 70.25,12.64 70.44,12.45 70.44,12.19 70.25,12 v1(67.27,12)
JTAG_TMS: length 53.8
  Top Layer w0.178: v1(63.97,15.62) 63.18,15.62 U25.3 ; U2.19 22.99,6.71 24.87,4.83 25.51,4.83 arc(25.66,4.89) 25.72,5.03 25.72,5.13 arc(25.92,5.33) 26.12,5.13 26.12,5.03 arc(26.33,4.83) 26.53,5.03 26.53,5.13 arc(26.73,5.33) 26.94,5.13 26.94,5.03 arc(27.14,4.83) 27.34,5.03 27.34,5.13 arc(27.55,5.33) 27.75,5.13 27.75,5.03 arc(27.95,4.83) 28.16,5.03 28.16,5.13 arc(28.36,5.33) 28.56,5.13 28.56,5.03 arc(28.77,4.83) 28.97,5.03 28.97,5.13 arc(29.17,5.33) 29.37,5.13 29.37,5.03 arc(29.58,4.83) 29.78,5.03 29.78,5.13 arc(29.98,5.33) 30.19,5.13 30.19,5.03 arc(30.39,4.83) 30.59,5.03 30.59,5.13 arc(30.8,5.33) 31,5.13 31,5.03 arc(31.06,4.89) 31.2,4.83 53.04,4.83 v1(57.36,9.14)
  Bottom Layer w0.178: v1(57.36,9.14) 63.84,15.62 v1(63.97,15.62)
JTAG_TMS_O: length 17.7
  Top Layer w0.178: U25.4 v1(67.27,15.56)
  Bottom Layer w0.178: v1(67.27,15.56) 66.31,15.56 65.74,16.13 65.74,16.61 arc(65.8,16.76) 65.95,16.81 66.59,16.81 arc(66.79,17.02) 66.59,17.22 64.9,17.22 arc(64.69,17.42) 64.9,17.63 66.33,17.63 arc(66.53,17.83) 66.33,18.03 65.95,18.03 arc(65.8,18.09) 65.74,18.24 65.74,18.92 66.63,19.81 70.82,19.81 70.95,19.69 70.95,18.68 U1.4
JTAG_VREF:
  vias: v1(46.51,12.93) v1(65.57,21.5) v1(65.57,20.9) v1(66.24,21.52) v1(66.23,20.91) v1(66.86,21.52) v1(66.85,20.91) v1(67.48,21.51) v1(67.48,20.9)
OSCI: length 9.4
  Top Layer w0.178: X1.1 16.75,21.77 17.79,20.74 18.06,20.74 18.93,19.87 18.93,18.46 19.89,17.5 19.89,16.63 20.02,16.5 20.45,16.5 20.53,16.58 U2.2
OSCO: length 9.4
  Top Layer w0.178: U2.3 20.53,16.08 20.45,16.17 19.88,16.17 19.56,16.49 19.56,17.37 18.6,18.33 18.6,19.73 17.92,20.41 17.79,20.41 16.75,19.37 X1.3
TCK_CONN: length 14.9
  Top Layer w0.178: U29.1 v1(87.29,8.63)
  Bottom Layer w0.178: v1(87.29,8.63) 86.33,8.63 86.06,8.89 86.06,9.4 86.19,9.52 87,9.52 arc(87.15,9.58) 87.2,9.73 87.2,9.96 arc(87.41,10.16) 87.61,9.96 87.61,9.73 arc(87.81,9.52) 88.02,9.73 88.02,9.8 arc(88.22,10) 88.42,9.8 88.42,9.73 arc(88.48,9.58) 88.63,9.52 91.78,9.52 92.03,9.78 92.03,10.03 90.9,11.16 U28.10
TDI_CONN: length 14.9
  Top Layer w0.178: U29.9 v1(87.29,18.79)
  Bottom Layer w0.178: v1(87.29,18.79) 87.29,16.3 87.71,15.88 87.97,15.88 88.35,16.26 88.35,17.4 88.86,17.91 91.78,17.91 91.91,17.78 91.91,17.4 91.78,17.27 90.76,17.27 90.64,17.15 90.64,16.34 U28.6
TDO_CONN: length 14.9
  Top Layer w0.178: U29.3 v1(87.29,11.17)
  Bottom Layer w0.178: v1(87.29,11.17) 86.33,11.17 86.06,11.43 86.06,11.68 86.44,12.06 86.88,12.06 arc(87.02,12.12) 87.08,12.27 87.08,12.62 arc(87.29,12.83) 87.49,12.62 87.49,12.27 arc(87.69,12.06) 87.9,12.27 87.9,12.44 arc(88.1,12.64) 88.3,12.44 88.3,12.27 arc(88.36,12.12) 88.5,12.06 91.65,12.06 91.91,12.32 91.91,12.53 U28.8
TMS_CONN: length 14.9
  Top Layer w0.178: U29.5 v1(87.29,13.71)
  Bottom Layer w0.178: v1(87.29,13.71) 86.06,14.93 86.06,19.18 86.57,19.68 86.93,19.68 arc(87.02,19.72) 87.06,19.82 arc(87.1,19.91) 87.19,19.95 87.33,19.95 arc(87.43,19.91) 87.47,19.82 arc(87.5,19.72) 87.6,19.68 89.83,19.68 U28.4
UART_RXD: length 47.7
  Top Layer w0.178: 30.32,12.56 29.48,12.56 v1(29.19,12.84) ; 49.29,12.02 49.29,11.83 48.69,11.22
  Bottom Layer w0.178: v1(48.75,11.28) 51.79,11.28 52.79,10.29 52.79,4.95 51.27,3.43 29.17,3.43 28.66,3.94 28.66,6.73 28.28,7.11 28.28,9.52 30.18,11.43 30.18,12.45 29.78,12.84 v1(29.19,12.84)
UART_RXD_O: length 42.1
  Top Layer w0.178: 55.56,16.61 55.58,16.64 57.51,16.64 U3.1 ; 55.56,16.61 v1(55.81,16.61) ; 55.56,16.61 54.92,15.98 53.09,15.98 52,14.88 51.27,14.88 50.99,14.6 50.99,12.25 51.24,12 52.04,12 ; 34.75,12.1 34.09,12.76
  Bottom Layer w0.178: v1(34.09,12.76) 34.09,14.02 arc(34.13,14.12) 34.23,14.16 arc(34.32,14.19) 34.36,14.29 34.36,14.43 arc(34.32,14.52) 34.23,14.56 arc(34.13,14.6) 34.09,14.7 34.09,15.34 38.18,19.42 49.37,19.42 49.87,18.92 49.87,16.51 50.76,15.62 54.82,15.62 v1(55.81,16.61)
UART_TXD: length 47.7
  Top Layer w0.178: v1(28.91,11.68) 29.31,12.08 30.31,12.08 ; 53.94,12.01 v1(53.94,11.3)
  Bottom Layer w0.178: v1(28.91,11.68) 27.26,10.03 27.26,3.68 28.79,2.16 51.77,2.16 53.94,4.33 53.94,5.88 arc(54,6.03) 54.14,6.08 54.67,6.08 arc(54.88,6.29) 54.67,6.49 54.14,6.49 arc(54,6.55) 53.94,6.69 v1(53.94,11.3)
UART_TXD_O: length 42.1
  Top Layer w0.178: v1(31.71,12.7) 31.91,12.7 R7.2 ; v1(57.36,10.92) 57.36,11.32 U26.4
  Bottom Layer w0.178: v1(31.71,12.7) 31.71,13.59 32.6,14.48 32.6,16.26 36.38,20.04 37.53,20.04 38.06,20.57 50.56,20.57 arc(50.7,20.51) 50.76,20.37 50.76,20.27 arc(50.97,20.07) 51.17,20.27 51.17,20.37 arc(51.37,20.57) 51.58,20.37 51.58,20.27 arc(51.78,20.07) 51.98,20.27 51.98,20.37 arc(52.04,20.51) 52.19,20.57 52.79,20.57 55.71,17.65 56.6,17.65 57.73,16.52 U3.2 57.73,11.29 v1(57.36,10.92)
USB_5V:
  vias: v1(7.09,15.86) v1(7.23,10.96) v1(7.7,15.68) v1(8.02,10.95) v1(12.32,16.56) v1(12.37,15.58) v1(12.75,14.76) v1(13.25,15.09) v1(13.7,15.55)
USB_CC1: length 3.7
  Top Layer w0.178: R2.2 10.82,14.61 7.36,14.61
USB_CC2: length 3.6
  Top Layer w0.178: 7.36,11.61 10.5,11.61 R1.2
USB_DN: length 9.3
  Top Layer w0.178: 7.65,14.11 7.71,14.11 7.75,14.07 8.27,14.07 8.31,14.11 8.45,14.11 v1(8.48,14.09) 8.56,14.09 9.37,13.28 9.79,13.28 arc(9.93,13.34) 9.99,13.48 arc(10.05,13.62) 10.19,13.68 10.2,13.68 arc(10.34,13.62) 10.4,13.48 arc(10.46,13.34) 10.6,13.28 13.46,13.28 13.51,13.33 L1.5 ; 7.36,13.11 7.37,13.1 v1(8.46,13.1)
  Top Layer w0.254: 7.65,14.11 7.36,14.11
  Bottom Layer w0.178: v1(8.48,14.09) 8.48,13.11 v1(8.46,13.1)
USB_DN_O: length 7
  Top Layer w0.178: L1.2 15.54,13.33 15.62,13.25 16.06,13.25 16.18,13.38 16.18,13.85 16.5,14.17 17.75,14.17 17.97,13.95 20.09,13.95 20.14,14 20.45,14 20.53,14.08 U2.7
USB_DP: length 7
  Top Layer w0.178: L1.6 13.54,12.95 9.24,12.95 8.55,13.64 8.04,13.64 v1(8.02,13.62)
  Bottom Layer w0.178: v1(8.01,12.61) 8.02,12.62 v1(8.02,13.62)
USB_DP_O: length 7
  Top Layer w0.178: L1.1 15.54,12.83 15.62,12.92 16.19,12.92 16.51,13.24 16.51,13.72 16.64,13.84 17.61,13.84 17.83,13.62 20.22,13.62 20.27,13.67 20.45,13.67 20.53,13.58 U2.8
VCORE: length 11.2
  Top Layer w0.254: 19.29,12.16 19.33,12.19 19.71,12.19 20.33,11.57 20.83,11.57 20.84,11.58 ; 22.01,17.92 21.96,17.97 21.96,18.63 21.48,19.11 21.35,19.11 20.56,19.9 20.56,20.48
  Top Layer w0.28: 30.65,11.59 31.63,11.59 32.59,10.63 ; 32.08,19.81 31.27,18.99 30.23,18.99 29.58,18.34 29.58,18.16 29.5,18.09 29.5,17.73
  vias: v1(19.95,11.98) v1(21.29,19.17) v1(30.27,19.01) v1(31.96,20.09) v1(32.13,11.1)
VREF_CONN:
  vias: v1(81.62,11.18) v1(81.62,10.03) v1(81.87,12.06) v1(82.63,10.16) v1(82.76,12.32) v1(83.9,10.03) v1(84.03,12.32) v1(85.05,12.32) v1(85.05,10.03) v1(89.59,23.3) v1(89.59,22.28) v1(90.73,22.28) v1(90.76,23.24) v1(91.87,23.3) v1(91.87,22.28)
VREF_SEL: length 10.3
  Top Layer w0.178: v1(44.91,13.72) 44.91,13.45 44.82,13.35 ; 37.11,16.07 38.53,17.49 40.91,17.49
  Bottom Layer w0.178: v1(44.91,13.72) 41.1,17.53 SW1.7
$1N3333: length 9.2
  Top Layer w0.178: 16.98,12.4 17.34,12.76 v1(17.34,12.79) ; 21.06,15.58 v1(22.16,15.58)
  Bottom Layer w0.178: v1(17.34,12.79) 17.66,13.11 21.85,13.11 22.59,13.85 22.59,15.26 22.31,15.54 22.22,15.54
$1N3334: length 3.6
  Top Layer w0.178: U2.9 21.16,13.08 18.25,13.08 17.99,12.83 L2.1
$1N3341: length 3.2
  Top Layer w0.178: 18.62,15.71 18.62,15.03 19.09,14.57 20.94,14.57
$1N3343: length 3.1
  Top Layer w0.178: 19.26,8.71 19.33,8.71 19.93,9.3 19.93,10.3 20.23,10.6 21.01,10.6
$1N3498: length 5.7
  Top Layer w0.178: R20.2 44.23,10.08 44.07,10.25 44.07,10.68 43.77,10.97 v1(43.77,11.3) ; 42.78,13.74 42.78,13.47 42.92,13.33 43.38,13.33
  Bottom Layer w0.178: v1(42.78,13.79) 43.82,12.75 43.82,11.29
$1N3540: length 1.1
  Top Layer w0.178: 13.34,16.57 13.34,16.68 13.52,16.86 14.17,16.86 14.23,16.8
$1N3543: length 1.3
  Top Layer w0.178: 17.3,16.62 17.06,16.62 16.63,16.18 16.23,16.18
  Top Layer w0.305: 17.35,16.56 R6.1
$1N3571: length 2.3
  Top Layer w0.178: 36.31,10.63 36.31,11.16 37,11.84 37.8,11.84
$1N3574: length 6.5
  Top Layer w0.178: 43.36,10.19 43.36,10.88 v1(43.24,11) ; v1(41.87,13.59) 42.12,13.33 42.12,11.94 42.03,11.84 U11.3
  Bottom Layer w0.178: 43.28,10.97 43.28,11.11 41.86,12.53 41.89,13.54
$1N4563: length 2.9
  Top Layer w0.178: 36.34,21 36.13,20.79 36.13,18.99 36.74,18.38
$1N7350: length 4.5
  Top Layer w0.178: 34.02,15.52 34.52,15.52 34.58,15.46 34.55,14.94 34.55,14.54 33.47,13.47 33.47,11.97
$1N7411: length 4.2
  Top Layer w0.178: 34.7,13.43 34.69,14.27 34.95,14.53 34.95,15.32 35.13,15.5 35.36,15.5 ; 34.7,13.43 34.7,13.02 35.49,12.22 35.55,12.22 ; 34.7,13.43 34.7,13.52
$1N7511: length 2.9
  Top Layer w0.178: 34.25,22.41 34.39,22.41 34.74,22.06 34.74,20.23 35.01,19.95
$1N7515: length 2
  Top Layer w0.178: 35.6,16.1 35.6,17.75 35.35,18
$1N7583: length 1.2
  Top Layer w0.178: 34.25,21.02 34.25,20.5 33.77,20.02
$1N7590: length 3.8
  Top Layer w0.178: 33.36,17.98 33.07,17.69 33.07,14.96 33.21,14.83 33.62,14.83
$1N18705: length 1.5
  Top Layer w0.178: R22.1 U22.5
$1N18713: length 1.5
  Top Layer w0.178: R23.1 U23.5
$1N18716: length 1.5
  Top Layer w0.178: R25.1 U25.5
$1N19227: length 3.3
  Top Layer w0.178: R26.1 55.76,12.75 55.96,12.95 U26.5
$1N19229: length 4.3
  Top Layer w0.178: 52.38,13.02 52.42,12.97 52.76,12.97 52.98,12.74 52.98,11.57 52.64,11.22 51.76,11.22 50.99,10.46
$1N19829: length 1.5
  Top Layer w0.178: R24.1 U24.5

## Copper pours and planes (outline as drawn; the poured copper is in the pictures)
3V3 on Top Layer: 15.03,11.95 18.34,11.95 18.34,9.94 15.03,9.94
3V3 on Top Layer: 59.14,18.03 60.41,18.03 60.41,15.62 59.14,15.62
3V3 on Top Layer: 25.83,22.62 31.19,22.62 31.19,18.09 25.83,18.09
3V3 on Top Layer: 25.67,23.5 30.87,23.5 30.87,22.97 25.67,22.97
3V3 on Top Layer: 30.38,24.01 33.62,24.01 33.62,20.81 30.38,20.81
3V3 on Top Layer: 25.67,23.23 26.75,23.23 26.75,21.91 25.67,21.91
3V3 on Inner2: 48.65,10.02 46.08,12.59 63.31,12.59 63.58,12.32 63.58,7.56 63.1,7.08 49.03,7.08 48.65,7.46
3V3 on Inner2: 39.33,10.67 43.2,10.67 43.17,15.28 37.64,19.19 31.63,14.79 31.63,11.81 38.26,11.81 39.33,10.75
3V3 on Inner2: 37.68,24.64 39.07,26.03 41.74,26.03 46.06,21.72 54.95,21.72 54.95,18.47 55.66,17.76 59.71,17.76 60.03,17.44 60.03,15.49 59.9,15.37 36.82,15.37 36.31,15.88 37.68,17.24
3V3 on Inner2: 37.81,8.07 37.87,2.73 39.96,0.64 67.84,0.64 67.84,6.53 64.47,6.53 62.1,8.9 46.86,8.9 43.69,12.06 39.35,12.13 39.39,8.08
3V3 on Inner2: 14.78,11.62 14.78,9.45 17.94,6.28 30.17,6.28 31.46,7.8 31.49,11.28 37.85,18.65 37.85,24.75 26.55,24.75 25.45,23.66 25.45,19.57 25.48,19.55 25.48,17.62 26.34,16.76 28.62,16.76 29.2,17.34 29.2,18.73 29.96,19.48 30.59,19.48 30.61,19.47 30.89,19.47 31.39,19.97 31.39,20.24 31.73,20.58 32.71,20.58 32.79,20.66 33.39,20.06 31.12,16.79 25.51,9.83 20.6,9.83 18.81,11.62
3V3 on Inner2: 39.2,16.38 59.65,16.38 59.65,15.24 39.35,15.24 39.2,15.88
3V3 on Inner2: 66.81,17.74 66.2,17.13 66.2,1.55 69.59,4.94 69.59,17.72 69.57,17.74
+5V on Top Layer: 15.99,15.78 16.85,15.78 16.85,14.57 15.99,14.57
+5V on Top Layer: 38.34,11.48 37.11,11.48 37.11,10.54 35.84,9.26 35.84,6.56 37.84,6.56 37.87,6.6 37.87,8.06 38.05,8.24 38.75,8.24 39.39,8.89 39.39,10.64 39.35,10.68 38.59,10.68 38.53,10.75 38.53,11.49 38.35,11.49
+5V on Top Layer: 8.6,9.08 13.83,9.08 13.83,7.77 8.6,7.77
+5V on Inner2: 8.4,9.71 12.28,9.71 17.03,4.96 30.74,4.96 33.13,7.35 33.13,10.78 33.9,11.55 38.4,11.55 38.57,11.38 38.57,10.83 38.79,10.61 39.38,10.61 39.44,10.55 39.44,8.86 38.62,8.05 37.95,8.05 37.83,7.93 37.83,2.25 11.61,2.25 8.4,5.46
+5V on Inner2: 8.4,10.37 12.1,14.07 12.7,14.07 14.91,16.28 17.09,16.28 17.09,14.11 16.61,13.94 13.81,13.48 13.8,13.49 13.58,13.38 13.54,13.25 13.22,12.04 13.22,9.58 13.12,8.73 12.58,8.73 8.4,8.73 8.4,8.73
GND on Top Layer: 17.11,15.98 18,15.98 18,14.79 17.11,14.79
GND on Top Layer: 0.11,12.65 18.42,12.65 18.42,-0.03 0.11,-0.03
GND on Top Layer: 15.73,15.11 15.73,13.79 15.49,13.55 11.74,13.55 11.52,13.76 11.52,15.31 11.52,15.31 11.99,15.31 12.11,15.2 12.11,15.01 12.26,14.85 12.26,14.61 12.5,14.37 13.13,14.37 13.58,14.82 14.14,14.82 14.65,15.33 14.65,15.76 14.83,15.94 15.73,15.94
GND on Top Layer: 0.03,26.67 10.45,26.67 10.45,17.03 0.03,17.03
GND on Top Layer: 20.87,16.93 20.4,16.93 20.17,17.15 20.17,17.68 19.27,18.59 19.27,19.88 19.27,19.89 19.27,19.95 16.37,22.85 14.19,22.85 13.65,22.3 13.65,18.75 13.8,18.6 16.51,18.6 17.66,19.75 17.98,19.75 18.28,19.45 18.28,18.07 19.33,17.02 19.33,16.38 19.82,15.89 20.42,15.89 20.49,15.82 20.49,15.42 20.68,15.23 20.75,15.23 20.93,15.04 21.05,15.04 21.05,14.95 21.04,14.94 20.41,14.94 20.05,15.29 19.73,15.29 19.32,15.7 19.32,15.85 18.9,16.28 18.34,16.28 18.08,16.54 18.08,17.3 17.71,17.67 17.71,18.62 17.48,18.85 17.37,18.85 16.6,18.08 13.49,18.08 13.13,18.45 13.13,22.5 14.02,23.4 16.68,23.4 19.78,20.3 19.78,18.89 20.81,17.86 20.81,17.44 21.03,17.22 21.03,17.09
GND on Top Layer: 80.6,26.67 92.97,26.67 92.97,0 80.6,0
GND on Top Layer: 6.65,17.67 17.3,17.67 17.3,15.92 6.65,15.92
GND on Top Layer: 45.73,5.97 46.36,6.59 46.36,13.76 48.47,15.88 51.65,15.88 54.36,18.59 61.8,18.59 61.8,26.67 74.12,26.67 74.12,0.04 57.96,0.04 57.96,9.56 57.87,9.65 57.11,9.65 53.42,5.97
GND on Top Layer: 30.93,23.16 32.44,23.16 32.44,20.6 30.93,20.6
GND on Top Layer: 10.37,26.42 56.09,26.42 56.22,26.54 56.22,18.09 40.92,18.09 37.97,21.04 35.45,21.04 35.45,21.79 34.95,22.29 34.95,23.68 34.12,24.51 25.87,24.51 25.48,24.13 25.48,22.13 24.85,21.49 24.37,21.97 24.21,21.97 24.21,22.73 23.71,23.24 21.8,23.24 21.17,22.61 21.17,22.33 20.55,21.71 17.25,25.02 10.12,25.02 10.12,26.16
GND on Top Layer: 19.96,7.75 19.96,3.58 22.76,0.78 41.12,0.78 42.3,1.96 74.06,1.96 74.07,0.04 17.96,0.09 17.96,7.75
GND on Top Layer: 25.87,7.89 25.87,6.19 26.63,5.43 41.81,5.43 41.81,7.83 41.38,8.26 40.61,8.26 40.17,8.69 40.17,8.81 40,8.98 40,10.49 39.85,10.65 39.45,10.65 39.45,9.75 39.36,9.66 38.57,9.66 38.74,9.5 39.46,9.5 39.46,8.69 38.83,8.07 38.07,8.07 37.94,7.94 37.83,7.94 37.83,6.67 37.63,6.47 35.82,6.47 35.47,6.83 35.47,8.52 35.82,8.87 36.43,8.87 36.49,8.93 36.49,9.33 36.26,9.56 36.26,9.58 35.91,9.93 35.91,11.15 36.24,11.48 36.24,12.43 37.74,13.93 37.74,15.38 37.5,15.62 36.62,15.62 36.24,15.24 35.27,15.24 35.09,15.06 35.09,13.07 35.84,12.32 35.84,11.73 35.83,11.72 35.16,11.72 35.13,11.69 33.48,11.69 32.94,11.16 31.67,11.01 30.03,11.03 30.05,8.09 29.16,6.74 28.98,6.56 28.4,6.56 27.06,7.89 25.87,7.89
GND on Top Layer: 12.09,14.62 11.59,14.62 11.54,14.57 11.54,14.63 11.3,14.87 8.14,14.87 8.11,14.91 8.11,16.18 8.68,16.75 10.14,16.75 10.24,16.65 10.24,15.69 10.58,15.35 11.92,15.35 12.23,15.04 12.23,14.34 12.23,14.34 12.16,14.26 11.96,14.26 11.96,14.49
GND on Top Layer: 41.25,6.33 43.45,6.33 44.53,7.41 44.53,10.86 44.14,11.25 44.46,11.58 45.46,11.58 45.57,11.47 45.57,10.3 45.41,10.14 45.41,10.01 45.81,9.61 46.14,9.61 46.65,9.11 46.65,6.6 45.97,5.91 44.43,5.91 44.01,5.49 41.34,5.49 41.25,5.58
GND on Top Layer: 30.82,21.53 42.39,21.53 42.39,14.88 30.82,14.88
GND on Bottom Layer: 0.08,26.67 74.07,26.67 74.07,0.04 0.08,0.04
GND on Bottom Layer: 80.6,26.67 92.97,26.67 92.97,0 80.6,0
GND on Inner1: 0.08,26.67 0.08,0.04 93.1,0.04 93.1,26.67
VCCB on Top Layer: 44.99,12.23 45.48,12.23 45.64,12.06 45.64,9.73 45.84,9.53 46.33,9.53 46.81,9.04 48.62,9.04 48.62,10.12 46.2,12.53 45.42,12.53 45.39,12.51 45.03,12.51 44.99,12.47
VCCB on Inner2: 43.38,12.7 43.26,12.7 43.26,14.48 44.03,15.24 60.67,15.24 60.67,13.9 45.36,13.9 45.17,13.72 45.17,12.7 45.3,12.57 46.01,12.57 46.69,11.89 46.69,10.41 45.66,10.41
VCCB on Inner2: 59.9,15.11 60.41,15.62 60.41,17.91 61.93,17.91 62.19,18.16 62.19,23.11 68.28,23.11 69.55,21.84 69.55,18.41 68.92,17.78 66.63,17.78 65.82,16.97 65.82,7.22 65.34,6.73 64.47,6.73 63.97,7.24 63.97,11.48 64.73,12.24 64.73,19.81 65.22,20.3 67.87,20.3 67.87,21.86 63.08,21.86 63.08,15.62 61.93,14.48 59.14,14.48 59.01,14.6 59.52,15.11
VCCB on Inner2: 45.17,12.5 46.22,12.51 48.6,10.16 48.6,9.04 46.85,9.01 45.17,10.76 45.15,11.68
INT_VERF on Top Layer: 40.75,11.53 40.75,10.82 40.69,10.76 40.03,10.76 40.02,10.77 39.99,10.74 39.99,8.93 40.72,8.2 41.84,8.2 42.36,7.68 42.36,7.64 43.11,6.88 43.11,6.78 43.3,6.59 43.88,6.59 43.94,6.66 43.94,9.55 43.87,9.63 42.94,9.63 42.49,10.08 42.49,11.58 40.8,11.58
INT_VERF on Top Layer: 42.07,13.22 42.12,13.26 44.17,13.26 44.17,12.36 44.17,12.36 43.47,12.36 43.47,12.12 43.21,11.86 42.99,11.54 42.86,11.02 42.86,9.5 42.76,9.4 42.25,9.4 42.07,9.57
JTAG_VREF on Bottom Layer: 65.11,21.72 69.93,21.72 69.93,20.7 65.11,20.7
JTAG_VREF on Inner2: 62.69,12.83 62.19,14.86 60.81,13.86 45.48,13.86 45.12,13.51 45.13,13.51 45.13,12.79 45.29,12.64
JTAG_VREF on Inner2: 63.2,15.62 63.2,21.72 67.78,21.72 67.78,20.7 66.89,20.7 66.5,20.32 64.6,20.32 64.6,12.83 61.55,12.83 61.55,13.97
USB_5V on Top Layer: 11.89,16 14.52,16 14.52,14.53 11.89,14.53
USB_5V on Inner2: 6.73,17.05 14.78,17.05 14.86,16.96 14.86,16.22 12.92,14.28 12.12,14.28 8.44,10.6 6.73,10.6 6.73,10.6
VCORE on Inner2: 20.16,11.61 14.69,11.65 14.7,9.19 17.77,6.11 30.17,6.11 31.7,7.64 31.7,11.32 32.09,11.72 32.63,11.72 32.78,11.57 32.78,7.19 30.7,5.12 17.08,5.12 13.31,8.89 13.65,13.33 16.73,13.64 20.13,15.44
VCORE on Inner2: 33.09,20.1 32.67,20.52 31.8,20.52 31.43,20.15 31.43,19.95 30.91,19.43 30.05,19.43 29.28,18.66 29.23,18.66 29.23,17.28 28.6,16.65 26.26,16.65 25.37,17.54 25.37,23.67 24.25,24.8 20.48,24.8 19.86,24.18 19.86,12.83 18.91,12.83 18.55,12.47 18.55,12.15 20.77,9.94 25.37,9.94 32.03,18.46
VREF_CONN on Bottom Layer: 88.98,23.62 92.29,23.62 92.29,21.46 88.98,21.46
VREF_CONN on Bottom Layer: 81.36,12.57 85.43,12.57 85.43,9.78 81.36,9.78
VREF_CONN on Inner2: 80.6,26.67 92.97,26.67 92.97,0 80.6,0
$1N3546 on Top Layer: 8.62,11.13 13.23,11.13 13.23,9.95 8.62,9.95

Small or netless copper shapes (teardrops, artwork), in the pictures only: 300 on Top Layer, 48 on Bottom Layer

## Text on the board
Bottom Silkscreen Layer: 2V5 | 1V8 | 3V3 | 1 | 0 | VREF | TMS | TCK | TDO | TDI | NC | OFF | ON | BOARG / VERF | JTAG / VERF
Top Silkscreen Layer: JLCJLCJLCJLC | 3V3 | 2V5 | 1V8 | TOP | BTM | RXD | TXD | GND | 1 | 0 | RF/IMPCAS
